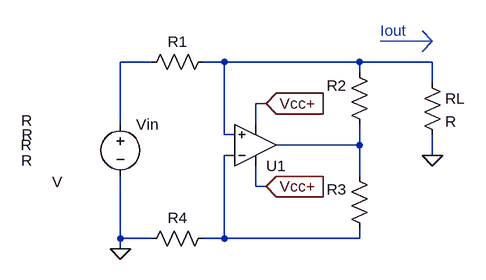
[diagram p0: schematic Draft2.asc]
Draft2.asc, the LTspice schematic file:
Version 4
SHEET 1 880 680
WIRE 112 48 64 48
WIRE 224 48 192 48
WIRE 432 48 224 48
WIRE 544 48 432 48
WIRE 432 64 432 48
WIRE 544 80 544 48
WIRE 288 112 272 112
WIRE 64 144 64 48
WIRE 272 144 272 112
WIRE 224 160 224 48
WIRE 240 160 224 160
WIRE 432 176 432 144
WIRE 432 176 304 176
WIRE 240 192 224 192
WIRE 544 192 544 160
WIRE 432 224 432 176
WIRE 272 240 272 208
WIRE 288 240 272 240
WIRE 64 320 64 224
WIRE 112 320 64 320
WIRE 224 320 224 192
WIRE 224 320 192 320
WIRE 432 320 432 304
WIRE 432 320 224 320
WIRE 64 336 64 320
FLAG 64 336 0
FLAG 288 240 Vcc+
IOPIN 288 240 In
FLAG 288 112 Vcc+
IOPIN 288 112 In
FLAG 544 192 0
SYMBOL voltage 64 128 R0
WINDOW 3 -105 105 Left 2
SYMATTR InstName Vin
SYMBOL Opamps\\UniversalOpamp2 272 176 M180
SYMATTR InstName U1
SYMBOL res 208 32 R90
WINDOW 0 0 56 VBottom 2
WINDOW 3 112 287 VTop 2
SYMATTR InstName R1
SYMBOL res 448 160 R180
WINDOW 0 36 76 Left 2
WINDOW 3 519 22 Left 2
SYMATTR InstName R2
SYMBOL res 448 320 R180
WINDOW 0 36 76 Left 2
WINDOW 3 520 144 Left 2
SYMATTR InstName R3
SYMBOL res 96 336 R270
WINDOW 0 32 56 VTop 2
WINDOW 3 152 -176 VBottom 2
SYMATTR InstName R4
SYMBOL res 528 64 R0
SYMATTR InstName RL
TEXT 464 0 Left 2 ;Iout
LINE Normal 544 16 464 16
LINE Normal 528 32 544 16
LINE Normal 544 16 528 32 2
LINE Normal 528 0 544 16

The netlist it stands for:
* Draft2.asc
Vin N001 0 V
XU1 N002 N004 Vcc+ Vcc+ N003 level.2 Avol=1Meg GBW=10Meg Slew=10Meg ilimit=25m rail=0 Vos=0 phimargin=45 en=0 enk=0 in=0 ink=0 Rin=500Meg  ; pins IN+ IN- V+ V- OUT
R1 N002 N001 R
R2 N003 N002 R
R3 N004 N003 R
R4 0 N004 R
RL N002 0 R
* Iout
.lib UniversalOpamps2.sub
.backanno
.end